# Altium project Artix Express UltraScale v2_2023-02-28T07_25_07_UTC.PrjPcb (part 2 of 7)

## Sheet FMC HPC Connector.SchDoc
size A1; SheetNumber: 13; SheetTotal: 16
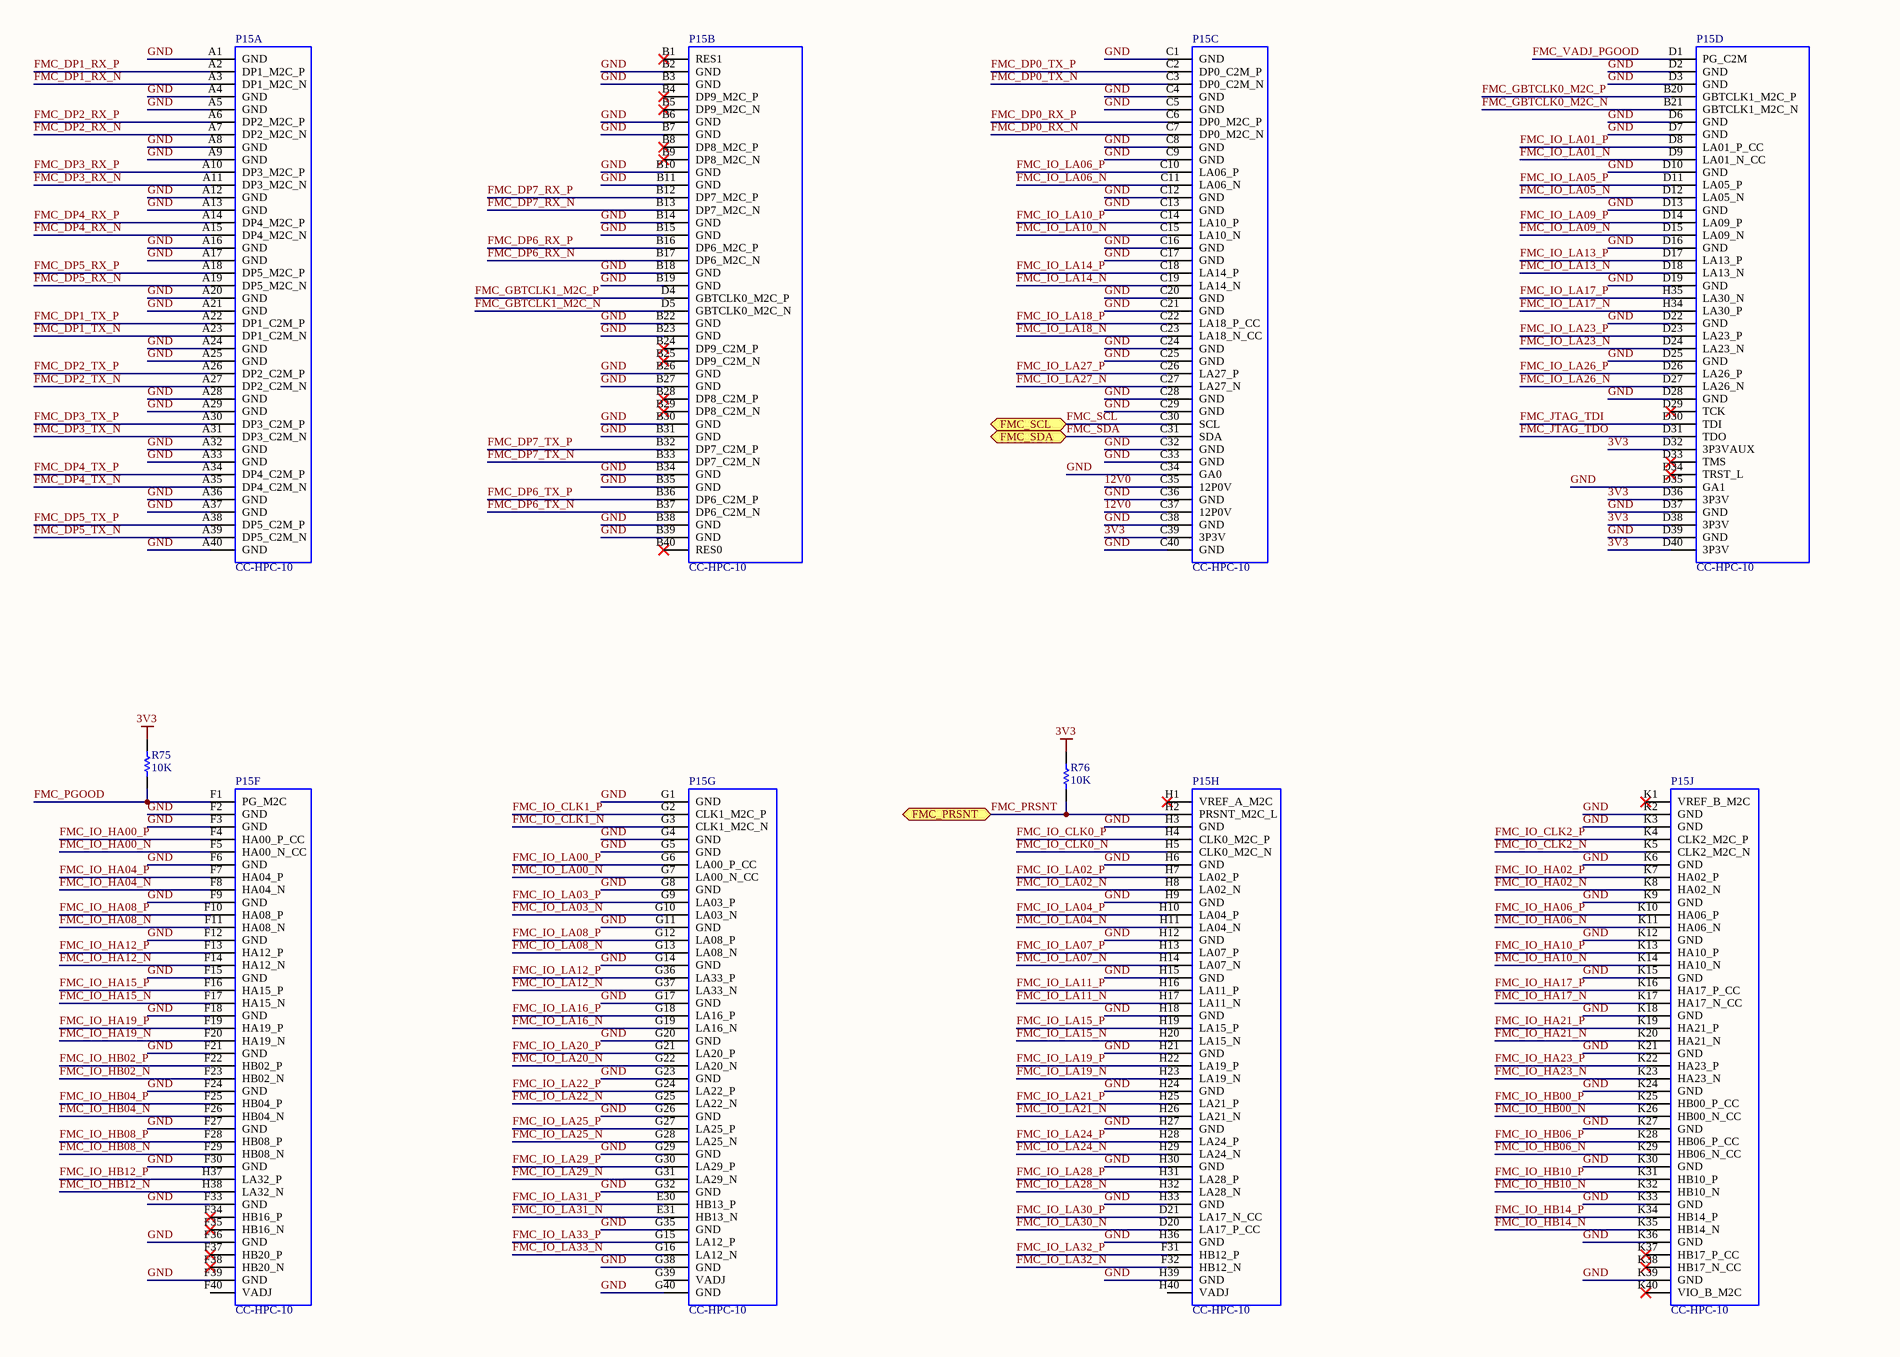
[diagram p3: FMC HPC Connector.SchDoc, top left]
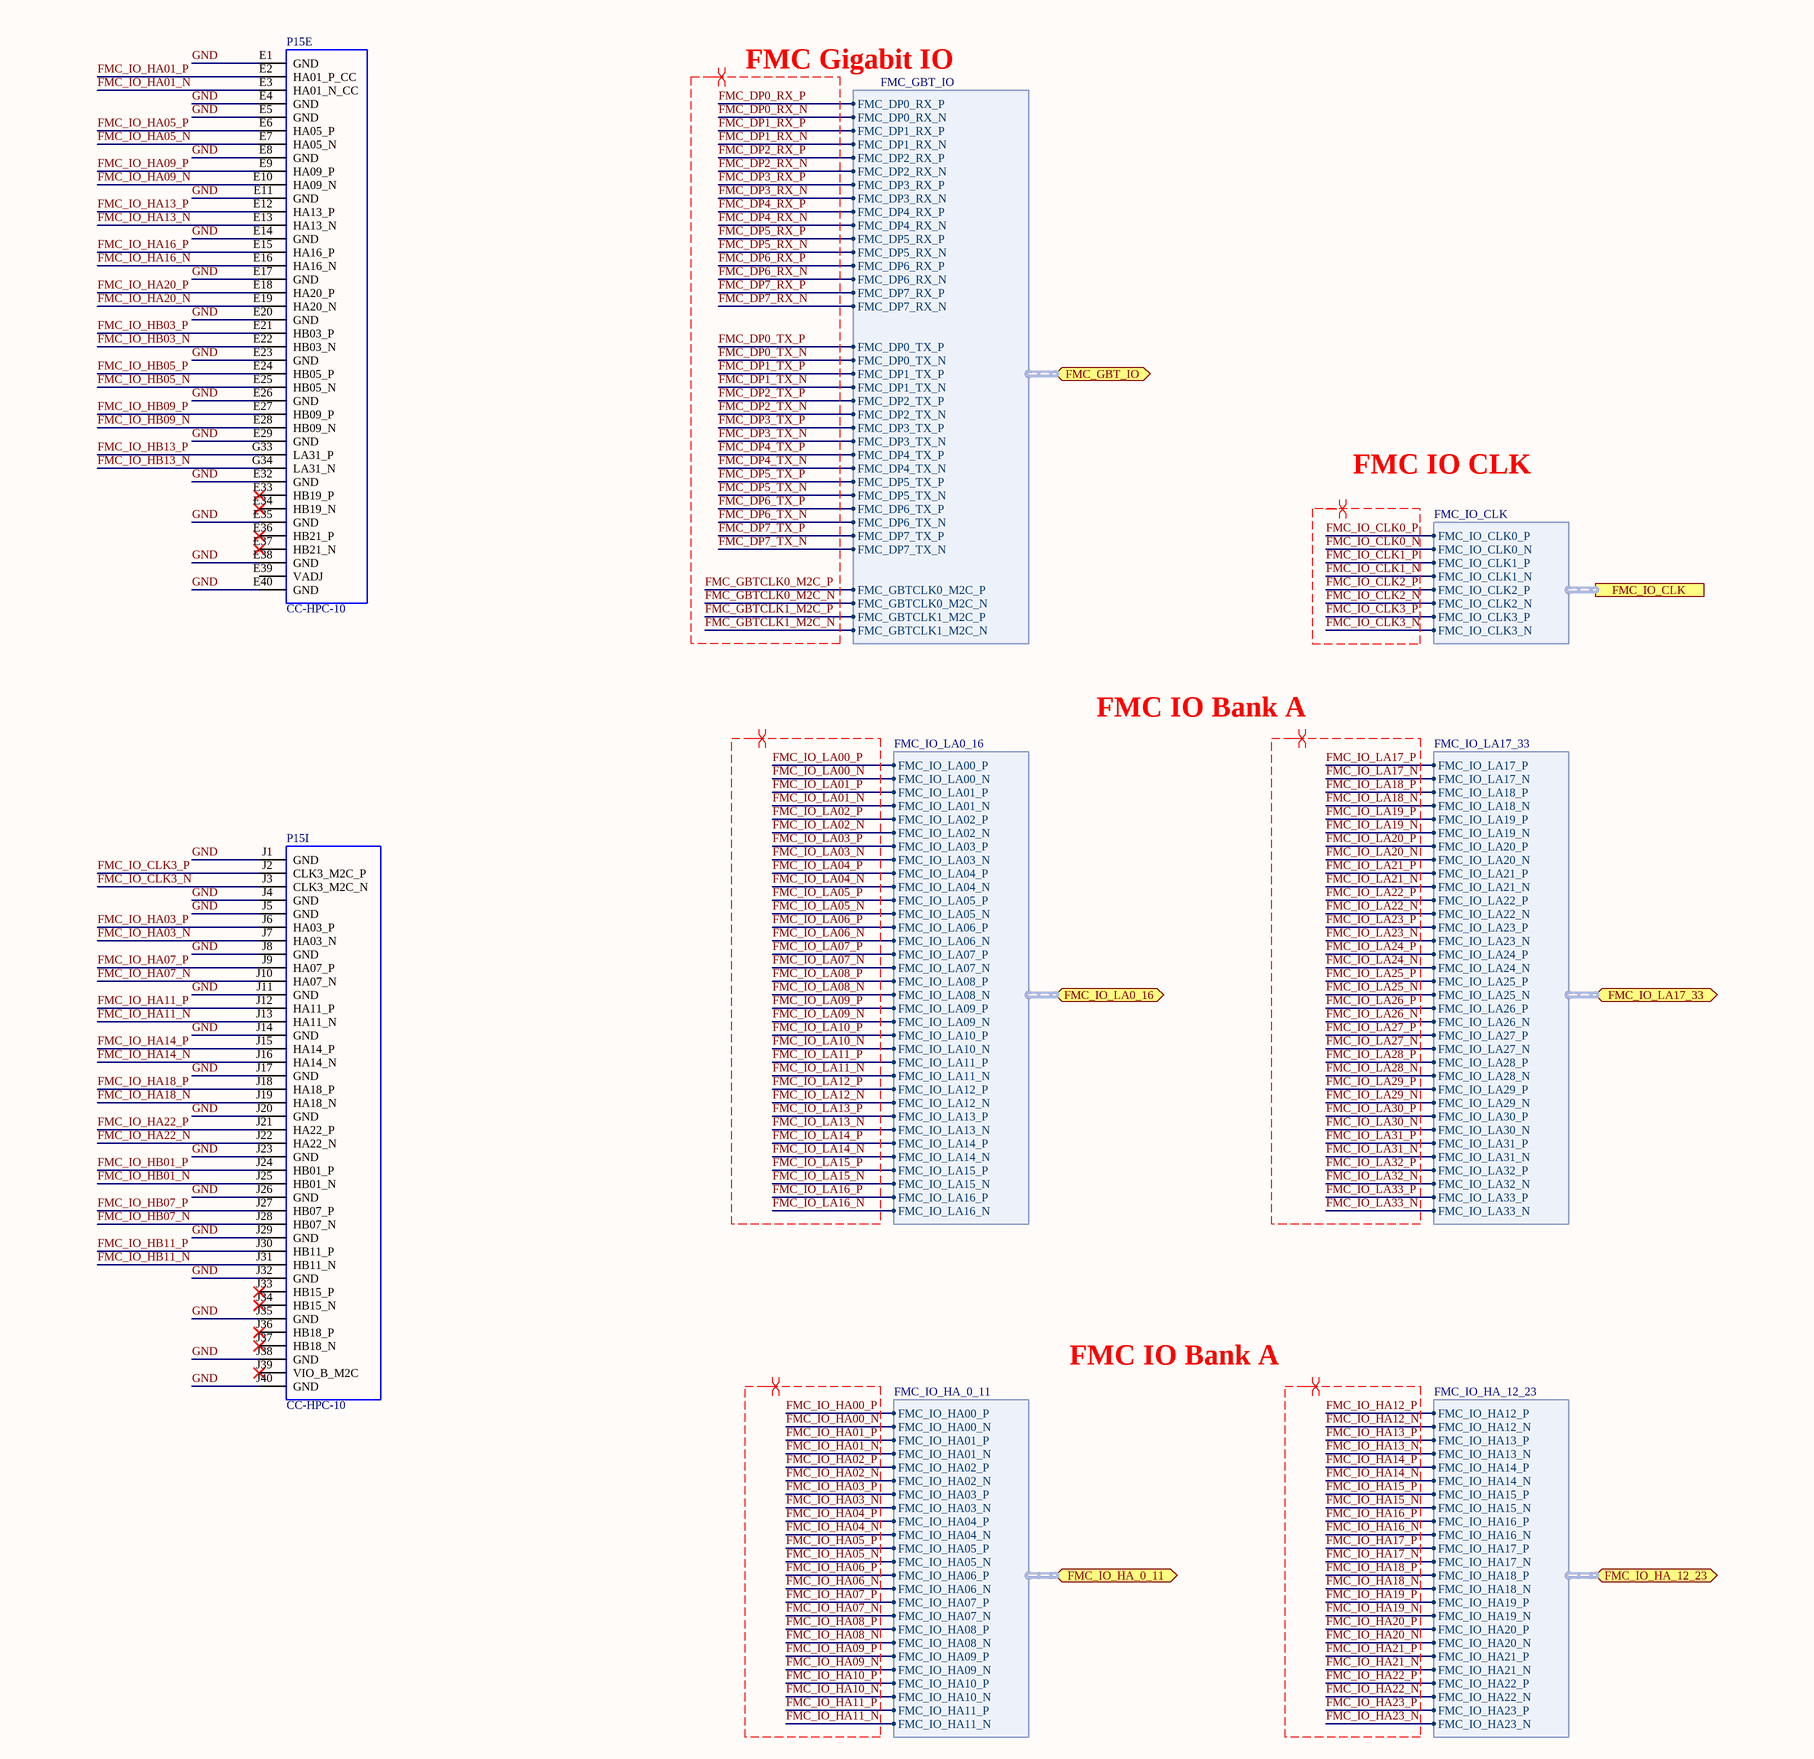
[diagram p4: FMC HPC Connector.SchDoc, top right]
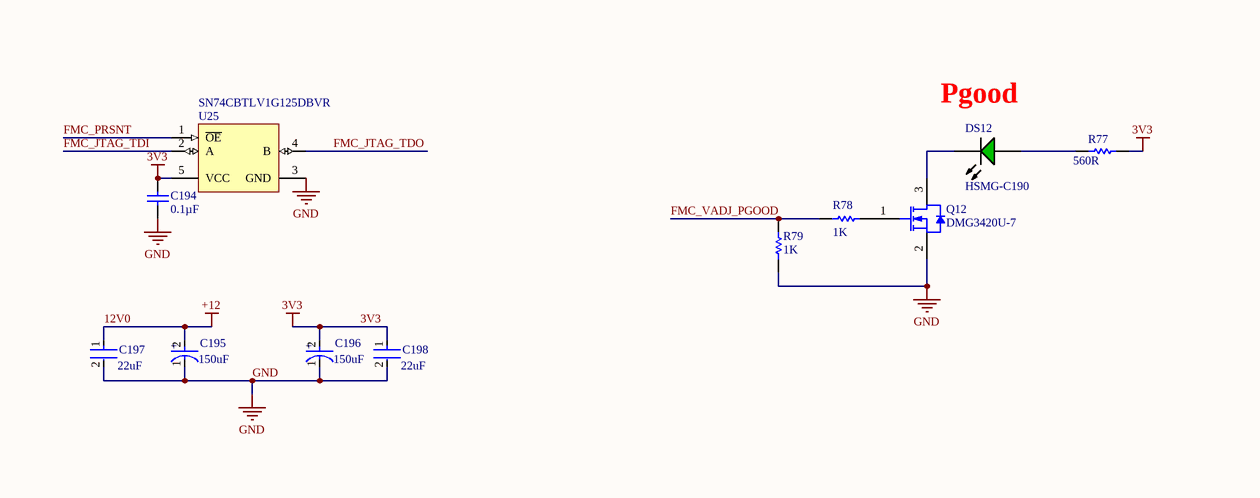
[diagram p5: FMC HPC Connector.SchDoc, bottom left]
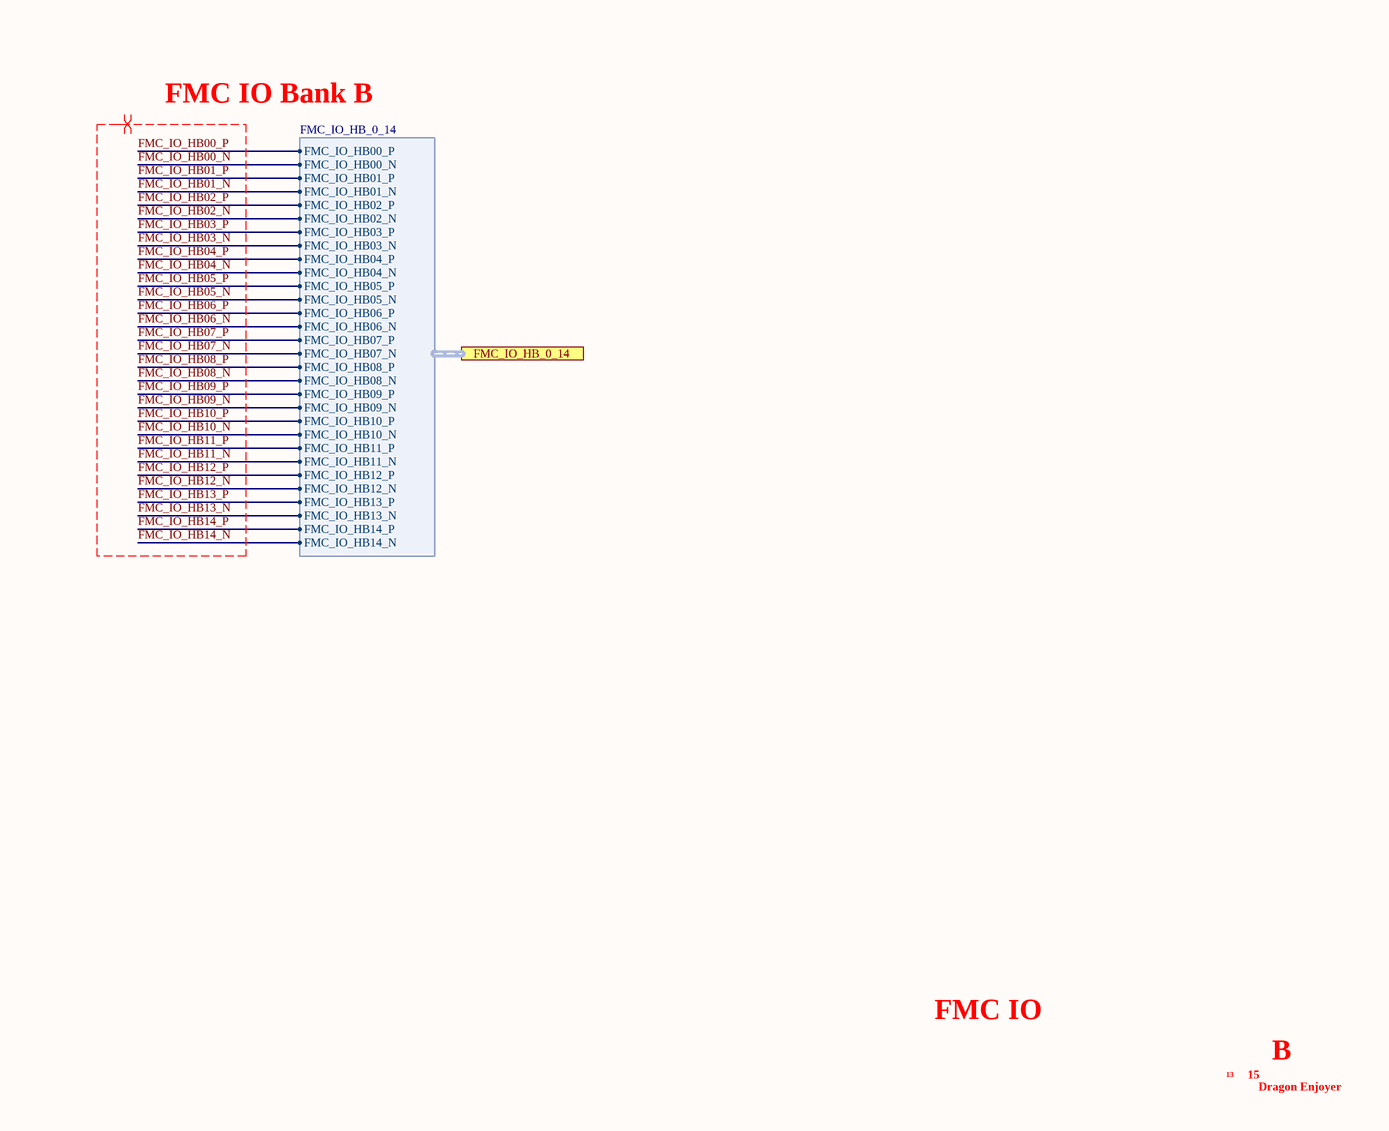
[diagram p6: FMC HPC Connector.SchDoc, bottom right]

### Parts
C194  Capacitance: 0.1µF  [CAPC1005X55X25LL05T05]  (hidden comment: CC0402ZRY5V8BB104)
C195  Capacitance: 150uF  [FP-TAJV-MFG]  (hidden comment: TAJV157M025RNJ)
C196  Capacitance: 150uF  [FP-TAJV-MFG]  (hidden comment: TAJV157M025RNJ)
C197  value 22uF  [FP-CL31H-0_2-MFG]  (hidden comment: CL31A226KAHNNNE)
C198  value 22uF  [FP-CL31H-0_2-MFG]  (hidden comment: CL31A226KAHNNNE)
DS12  HSMG-C190  [AVAG-HSMX-C190_V]
P15  CC-HPC-10  [ASP-134486-01]  (parts A,B,C,D,E,F,G,H,I,J of 10)
Q12  DMG3420U-7  [DIOD-SOT23-3_B_V]
R75  10K  [RESC1005X40X25NL05T05]
R76  10K  [RESC1005X40X25NL05T05]
R77  value 560R  [RESC1608X55X30LL20T20]  (hidden comment: ERA3AEB561V)
R78  value 1K  [RESC1005X40X25NL05T10]  (hidden comment: RC0402FR-071KL)
R79  value 1K  [RESC1005X40X25NL05T10]  (hidden comment: RC0402FR-071KL)
U25  SN74CBTLV1G125DBVR  [DBV0005A_N]

### Ports
FMC_GBT_IO (bidir, harness FMC_GBT_IO), FMC_IO_CLK (harness FMC_IO_CLK), FMC_IO_HA_0_11 (bidir, harness FMC_IO_HA_0_11), FMC_IO_HA_12_23 (bidir, harness FMC_IO_HA_12_23), FMC_IO_HB_0_14 (harness FMC_IO_HB_0_14), FMC_IO_LA0_16 (bidir, harness FMC_IO_LA0_16), FMC_IO_LA17_33 (bidir, harness FMC_IO_LA17_33), FMC_PRSNT (bidir), FMC_SCL (bidir), FMC_SDA (bidir)

### Harnesses
FMC_GBT_IO: FMC_DP0_RX_P, FMC_DP0_RX_N, FMC_DP1_RX_P, FMC_DP1_RX_N, FMC_DP2_RX_P, FMC_DP2_RX_N, FMC_DP3_RX_P, FMC_DP3_RX_N, FMC_DP4_RX_P, FMC_DP4_RX_N, FMC_DP5_RX_P, FMC_DP5_RX_N, FMC_DP6_RX_P, FMC_DP6_RX_N, FMC_DP7_RX_P, FMC_DP7_RX_N, FMC_DP0_TX_P, FMC_DP0_TX_N, FMC_DP1_TX_P, FMC_DP1_TX_N, FMC_DP2_TX_P, FMC_DP2_TX_N, FMC_DP3_TX_P, FMC_DP3_TX_N, FMC_DP4_TX_P, FMC_DP4_TX_N, FMC_DP5_TX_P, FMC_DP5_TX_N, FMC_DP6_TX_P, FMC_DP6_TX_N, FMC_DP7_TX_P, FMC_DP7_TX_N, FMC_GBTCLK0_M2C_P, FMC_GBTCLK0_M2C_N, FMC_GBTCLK1_M2C_P, FMC_GBTCLK1_M2C_N
FMC_IO_LA0_16: FMC_IO_LA00_P, FMC_IO_LA00_N, FMC_IO_LA01_P, FMC_IO_LA01_N, FMC_IO_LA02_P, FMC_IO_LA02_N, FMC_IO_LA03_P, FMC_IO_LA03_N, FMC_IO_LA04_P, FMC_IO_LA04_N, FMC_IO_LA05_P, FMC_IO_LA05_N, FMC_IO_LA06_P, FMC_IO_LA06_N, FMC_IO_LA07_P, FMC_IO_LA07_N, FMC_IO_LA08_P, FMC_IO_LA08_N, FMC_IO_LA09_P, FMC_IO_LA09_N, FMC_IO_LA10_P, FMC_IO_LA10_N, FMC_IO_LA11_P, FMC_IO_LA11_N, FMC_IO_LA12_P, FMC_IO_LA12_N, FMC_IO_LA13_P, FMC_IO_LA13_N, FMC_IO_LA14_P, FMC_IO_LA14_N, FMC_IO_LA15_P, FMC_IO_LA15_N, FMC_IO_LA16_P, FMC_IO_LA16_N
FMC_IO_LA17_33: FMC_IO_LA17_P, FMC_IO_LA17_N, FMC_IO_LA18_P, FMC_IO_LA18_N, FMC_IO_LA19_P, FMC_IO_LA19_N, FMC_IO_LA20_P, FMC_IO_LA20_N, FMC_IO_LA21_P, FMC_IO_LA21_N, FMC_IO_LA22_P, FMC_IO_LA22_N, FMC_IO_LA23_P, FMC_IO_LA23_N, FMC_IO_LA24_P, FMC_IO_LA24_N, FMC_IO_LA25_P, FMC_IO_LA25_N, FMC_IO_LA26_P, FMC_IO_LA26_N, FMC_IO_LA27_P, FMC_IO_LA27_N, FMC_IO_LA28_P, FMC_IO_LA28_N, FMC_IO_LA29_P, FMC_IO_LA29_N, FMC_IO_LA30_P, FMC_IO_LA30_N, FMC_IO_LA31_P, FMC_IO_LA31_N, FMC_IO_LA32_P, FMC_IO_LA32_N, FMC_IO_LA33_P, FMC_IO_LA33_N
FMC_IO_HA_0_11: FMC_IO_HA00_P, FMC_IO_HA00_N, FMC_IO_HA01_P, FMC_IO_HA01_N, FMC_IO_HA02_P, FMC_IO_HA02_N, FMC_IO_HA03_P, FMC_IO_HA03_N, FMC_IO_HA04_P, FMC_IO_HA04_N, FMC_IO_HA05_P, FMC_IO_HA05_N, FMC_IO_HA06_P, FMC_IO_HA06_N, FMC_IO_HA07_P, FMC_IO_HA07_N, FMC_IO_HA08_P, FMC_IO_HA08_N, FMC_IO_HA09_P, FMC_IO_HA09_N, FMC_IO_HA10_P, FMC_IO_HA10_N, FMC_IO_HA11_P, FMC_IO_HA11_N
FMC_IO_HA_12_23: FMC_IO_HA12_P, FMC_IO_HA12_N, FMC_IO_HA13_P, FMC_IO_HA13_N, FMC_IO_HA14_P, FMC_IO_HA14_N, FMC_IO_HA15_P, FMC_IO_HA15_N, FMC_IO_HA16_P, FMC_IO_HA16_N, FMC_IO_HA17_P, FMC_IO_HA17_N, FMC_IO_HA18_P, FMC_IO_HA18_N, FMC_IO_HA19_P, FMC_IO_HA19_N, FMC_IO_HA20_P, FMC_IO_HA20_N, FMC_IO_HA21_P, FMC_IO_HA21_N, FMC_IO_HA22_P, FMC_IO_HA22_N, FMC_IO_HA23_P, FMC_IO_HA23_N
FMC_IO_CLK: FMC_IO_CLK0_P, FMC_IO_CLK0_N, FMC_IO_CLK1_P, FMC_IO_CLK1_N, FMC_IO_CLK2_P, FMC_IO_CLK2_N, FMC_IO_CLK3_P, FMC_IO_CLK3_N
FMC_IO_HB_0_14: FMC_IO_HB00_P, FMC_IO_HB00_N, FMC_IO_HB01_P, FMC_IO_HB01_N, FMC_IO_HB02_P, FMC_IO_HB02_N, FMC_IO_HB03_P, FMC_IO_HB03_N, FMC_IO_HB04_P, FMC_IO_HB04_N, FMC_IO_HB05_P, FMC_IO_HB05_N, FMC_IO_HB06_P, FMC_IO_HB06_N, FMC_IO_HB07_P, FMC_IO_HB07_N, FMC_IO_HB08_P, FMC_IO_HB08_N, FMC_IO_HB09_P, FMC_IO_HB09_N, FMC_IO_HB10_P, FMC_IO_HB10_N, FMC_IO_HB11_P, FMC_IO_HB11_N, FMC_IO_HB12_P, FMC_IO_HB12_N, FMC_IO_HB13_P, FMC_IO_HB13_N, FMC_IO_HB14_P, FMC_IO_HB14_N

### Nets
3V3: C194.2 C196.2(A) C198.1 P15.C39(3P3V) P15.D32(3P3VAUX) P15.D36(3P3V) P15.D38(3P3V) P15.D40(3P3V) R75.2 R76.2 R77.2 U25.5(VCC)  [project net +3V3]
+12: C195.2(A) C197.1 P15.C35(12P0V) P15.C37(12P0V)  [also labelled 12V0]
GND: C194.1 C195.1(C) C196.1(C) C197.2 C198.2 P15.A1(GND) P15.A4(GND) P15.A5(GND) P15.A8(GND) P15.A9(GND) P15.A12(GND) P15.A13(GND) P15.A16(GND) P15.A17(GND) P15.A20(GND) P15.A21(GND) P15.A24(GND) P15.A25(GND) P15.A28(GND) P15.A29(GND) P15.A32(GND) P15.A33(GND) P15.A36(GND) P15.A37(GND) P15.A40(GND) P15.B2(GND) P15.B3(GND) P15.B6(GND) P15.B7(GND) P15.B10(GND) P15.B11(GND) P15.B14(GND) P15.B15(GND) P15.B18(GND) P15.B19(GND) P15.B22(GND) P15.B23(GND) P15.B26(GND) P15.B27(GND) P15.B30(GND) P15.B31(GND) P15.B34(GND) P15.B35(GND) P15.B38(GND) P15.B39(GND) P15.C1(GND) P15.C4(GND) P15.C5(GND) P15.C8(GND) P15.C9(GND) P15.C12(GND) P15.C13(GND) P15.C16(GND) P15.C17(GND) P15.C20(GND) P15.C21(GND) P15.C24(GND) P15.C25(GND) P15.C28(GND) P15.C29(GND) P15.C32(GND) P15.C33(GND) P15.C34(GA0) P15.C36(GND) P15.C38(GND) P15.C40(GND) P15.D2(GND) P15.D3(GND) P15.D6(GND) P15.D7(GND) P15.D10(GND) P15.D13(GND) P15.D16(GND) P15.D19(GND) P15.D22(GND) P15.D25(GND) P15.D28(GND) P15.D35(GA1) P15.D37(GND) P15.D39(GND) P15.E1(GND) P15.E4(GND) P15.E5(GND) P15.E8(GND) P15.E11(GND) P15.E14(GND) P15.E17(GND) P15.E20(GND) P15.E23(GND) P15.E26(GND) P15.E29(GND) P15.E32(GND) P15.E35(GND) P15.E38(GND) P15.E40(GND) P15.F2(GND) P15.F3(GND) P15.F6(GND) P15.F9(GND) P15.F12(GND) P15.F15(GND) P15.F18(GND) P15.F21(GND) P15.F24(GND) P15.F27(GND) P15.F30(GND) P15.F33(GND) P15.F36(GND) P15.F39(GND) P15.G1(GND) P15.G4(GND) P15.G5(GND) P15.G8(GND) P15.G11(GND) P15.G14(GND) P15.G17(GND) P15.G20(GND) P15.G23(GND) P15.G26(GND) P15.G29(GND) P15.G32(GND) P15.G35(GND) P15.G38(GND) P15.G40(GND) P15.H3(GND) P15.H6(GND) P15.H9(GND) P15.H12(GND) P15.H15(GND) P15.H18(GND) P15.H21(GND) P15.H24(GND) P15.H27(GND) P15.H30(GND) P15.H33(GND) P15.H36(GND) P15.H39(GND) P15.J1(GND) P15.J4(GND) P15.J5(GND) P15.J8(GND) P15.J11(GND) P15.J14(GND) P15.J17(GND) P15.J20(GND) P15.J23(GND) P15.J26(GND) P15.J29(GND) P15.J32(GND) P15.J35(GND) P15.J38(GND) P15.J40(GND) P15.K2(GND) P15.K3(GND) P15.K6(GND) P15.K9(GND) P15.K12(GND) P15.K15(GND) P15.K18(GND) P15.K21(GND) P15.K24(GND) P15.K27(GND) P15.K30(GND) P15.K33(GND) P15.K36(GND) P15.K39(GND) Q12.2(S) R79.1 U25.3(GND)
FMC_DP0_RX_N: P15.C7(DP0_M2C_N) ; port FMC_GBT_IO.FMC_DP0_RX_N
FMC_DP0_RX_P: P15.C6(DP0_M2C_P) ; port FMC_GBT_IO.FMC_DP0_RX_P
FMC_DP0_TX_N: P15.C3(DP0_C2M_N) ; port FMC_GBT_IO.FMC_DP0_TX_N
FMC_DP0_TX_P: P15.C2(DP0_C2M_P) ; port FMC_GBT_IO.FMC_DP0_TX_P
FMC_DP1_RX_N: P15.A3(DP1_M2C_N) ; port FMC_GBT_IO.FMC_DP1_RX_N
FMC_DP1_RX_P: P15.A2(DP1_M2C_P) ; port FMC_GBT_IO.FMC_DP1_RX_P
FMC_DP1_TX_N: P15.A23(DP1_C2M_N) ; port FMC_GBT_IO.FMC_DP1_TX_N
FMC_DP1_TX_P: P15.A22(DP1_C2M_P) ; port FMC_GBT_IO.FMC_DP1_TX_P
FMC_DP2_RX_N: P15.A7(DP2_M2C_N) ; port FMC_GBT_IO.FMC_DP2_RX_N
FMC_DP2_RX_P: P15.A6(DP2_M2C_P) ; port FMC_GBT_IO.FMC_DP2_RX_P
FMC_DP2_TX_N: P15.A27(DP2_C2M_N) ; port FMC_GBT_IO.FMC_DP2_TX_N
FMC_DP2_TX_P: P15.A26(DP2_C2M_P) ; port FMC_GBT_IO.FMC_DP2_TX_P
FMC_DP3_RX_N: P15.A11(DP3_M2C_N) ; port FMC_GBT_IO.FMC_DP3_RX_N
FMC_DP3_RX_P: P15.A10(DP3_M2C_P) ; port FMC_GBT_IO.FMC_DP3_RX_P
FMC_DP3_TX_N: P15.A31(DP3_C2M_N) ; port FMC_GBT_IO.FMC_DP3_TX_N
FMC_DP3_TX_P: P15.A30(DP3_C2M_P) ; port FMC_GBT_IO.FMC_DP3_TX_P
FMC_DP4_RX_N: P15.A15(DP4_M2C_N) ; port FMC_GBT_IO.FMC_DP4_RX_N
FMC_DP4_RX_P: P15.A14(DP4_M2C_P) ; port FMC_GBT_IO.FMC_DP4_RX_P
FMC_DP4_TX_N: P15.A35(DP4_C2M_N) ; port FMC_GBT_IO.FMC_DP4_TX_N
FMC_DP4_TX_P: P15.A34(DP4_C2M_P) ; port FMC_GBT_IO.FMC_DP4_TX_P
FMC_DP5_RX_N: P15.A19(DP5_M2C_N) ; port FMC_GBT_IO.FMC_DP5_RX_N
FMC_DP5_RX_P: P15.A18(DP5_M2C_P) ; port FMC_GBT_IO.FMC_DP5_RX_P
FMC_DP5_TX_N: P15.A39(DP5_C2M_N) ; port FMC_GBT_IO.FMC_DP5_TX_N
FMC_DP5_TX_P: P15.A38(DP5_C2M_P) ; port FMC_GBT_IO.FMC_DP5_TX_P
FMC_DP6_RX_N: P15.B17(DP6_M2C_N) ; port FMC_GBT_IO.FMC_DP6_RX_N
FMC_DP6_RX_P: P15.B16(DP6_M2C_P) ; port FMC_GBT_IO.FMC_DP6_RX_P
FMC_DP6_TX_N: P15.B37(DP6_C2M_N) ; port FMC_GBT_IO.FMC_DP6_TX_N
FMC_DP6_TX_P: P15.B36(DP6_C2M_P) ; port FMC_GBT_IO.FMC_DP6_TX_P
FMC_DP7_RX_N: P15.B13(DP7_M2C_N) ; port FMC_GBT_IO.FMC_DP7_RX_N
FMC_DP7_RX_P: P15.B12(DP7_M2C_P) ; port FMC_GBT_IO.FMC_DP7_RX_P
FMC_DP7_TX_N: P15.B33(DP7_C2M_N) ; port FMC_GBT_IO.FMC_DP7_TX_N
FMC_DP7_TX_P: P15.B32(DP7_C2M_P) ; port FMC_GBT_IO.FMC_DP7_TX_P
FMC_GBTCLK0_M2C_N: P15.B21(GBTCLK1_M2C_N) ; port FMC_GBT_IO.FMC_GBTCLK0_M2C_N
FMC_GBTCLK0_M2C_P: P15.B20(GBTCLK1_M2C_P) ; port FMC_GBT_IO.FMC_GBTCLK0_M2C_P
FMC_GBTCLK1_M2C_N: P15.D5(GBTCLK0_M2C_N) ; port FMC_GBT_IO.FMC_GBTCLK1_M2C_N
FMC_GBTCLK1_M2C_P: P15.D4(GBTCLK0_M2C_P) ; port FMC_GBT_IO.FMC_GBTCLK1_M2C_P
FMC_IO_CLK0_N: P15.H5(CLK0_M2C_N) ; port FMC_IO_CLK.FMC_IO_CLK0_N
FMC_IO_CLK0_P: P15.H4(CLK0_M2C_P) ; port FMC_IO_CLK.FMC_IO_CLK0_P
FMC_IO_CLK1_N: P15.G3(CLK1_M2C_N) ; port FMC_IO_CLK.FMC_IO_CLK1_N
FMC_IO_CLK1_P: P15.G2(CLK1_M2C_P) ; port FMC_IO_CLK.FMC_IO_CLK1_P
FMC_IO_CLK2_N: P15.K5(CLK2_M2C_N) ; port FMC_IO_CLK.FMC_IO_CLK2_N
FMC_IO_CLK2_P: P15.K4(CLK2_M2C_P) ; port FMC_IO_CLK.FMC_IO_CLK2_P
FMC_IO_CLK3_N: P15.J3(CLK3_M2C_N) ; port FMC_IO_CLK.FMC_IO_CLK3_N
FMC_IO_CLK3_P: P15.J2(CLK3_M2C_P) ; port FMC_IO_CLK.FMC_IO_CLK3_P
FMC_IO_HA00_N: P15.F5(HA00_N_CC) ; port FMC_IO_HA_0_11.FMC_IO_HA00_N
FMC_IO_HA00_P: P15.F4(HA00_P_CC) ; port FMC_IO_HA_0_11.FMC_IO_HA00_P
FMC_IO_HA01_N: P15.E3(HA01_N_CC) ; port FMC_IO_HA_0_11.FMC_IO_HA01_N
FMC_IO_HA01_P: P15.E2(HA01_P_CC) ; port FMC_IO_HA_0_11.FMC_IO_HA01_P
FMC_IO_HA02_N: P15.K8(HA02_N) ; port FMC_IO_HA_0_11.FMC_IO_HA02_N
FMC_IO_HA02_P: P15.K7(HA02_P) ; port FMC_IO_HA_0_11.FMC_IO_HA02_P
FMC_IO_HA03_N: P15.J7(HA03_N) ; port FMC_IO_HA_0_11.FMC_IO_HA03_N
FMC_IO_HA03_P: P15.J6(HA03_P) ; port FMC_IO_HA_0_11.FMC_IO_HA03_P
FMC_IO_HA04_N: P15.F8(HA04_N) ; port FMC_IO_HA_0_11.FMC_IO_HA04_N
FMC_IO_HA04_P: P15.F7(HA04_P) ; port FMC_IO_HA_0_11.FMC_IO_HA04_P
FMC_IO_HA05_N: P15.E7(HA05_N) ; port FMC_IO_HA_0_11.FMC_IO_HA05_N
FMC_IO_HA05_P: P15.E6(HA05_P) ; port FMC_IO_HA_0_11.FMC_IO_HA05_P
FMC_IO_HA06_N: P15.K11(HA06_N) ; port FMC_IO_HA_0_11.FMC_IO_HA06_N
FMC_IO_HA06_P: P15.K10(HA06_P) ; port FMC_IO_HA_0_11.FMC_IO_HA06_P
FMC_IO_HA07_N: P15.J10(HA07_N) ; port FMC_IO_HA_0_11.FMC_IO_HA07_N
FMC_IO_HA07_P: P15.J9(HA07_P) ; port FMC_IO_HA_0_11.FMC_IO_HA07_P
FMC_IO_HA08_N: P15.F11(HA08_N) ; port FMC_IO_HA_0_11.FMC_IO_HA08_N
FMC_IO_HA08_P: P15.F10(HA08_P) ; port FMC_IO_HA_0_11.FMC_IO_HA08_P
FMC_IO_HA09_N: P15.E10(HA09_N) ; port FMC_IO_HA_0_11.FMC_IO_HA09_N
FMC_IO_HA09_P: P15.E9(HA09_P) ; port FMC_IO_HA_0_11.FMC_IO_HA09_P
FMC_IO_HA10_N: P15.K14(HA10_N) ; port FMC_IO_HA_0_11.FMC_IO_HA10_N
FMC_IO_HA10_P: P15.K13(HA10_P) ; port FMC_IO_HA_0_11.FMC_IO_HA10_P
FMC_IO_HA11_N: P15.J13(HA11_N) ; port FMC_IO_HA_0_11.FMC_IO_HA11_N
FMC_IO_HA11_P: P15.J12(HA11_P) ; port FMC_IO_HA_0_11.FMC_IO_HA11_P
FMC_IO_HA12_N: P15.F14(HA12_N) ; port FMC_IO_HA_12_23.FMC_IO_HA12_N
FMC_IO_HA12_P: P15.F13(HA12_P) ; port FMC_IO_HA_12_23.FMC_IO_HA12_P
FMC_IO_HA13_N: P15.E13(HA13_N) ; port FMC_IO_HA_12_23.FMC_IO_HA13_N
FMC_IO_HA13_P: P15.E12(HA13_P) ; port FMC_IO_HA_12_23.FMC_IO_HA13_P
FMC_IO_HA14_N: P15.J16(HA14_N) ; port FMC_IO_HA_12_23.FMC_IO_HA14_N
FMC_IO_HA14_P: P15.J15(HA14_P) ; port FMC_IO_HA_12_23.FMC_IO_HA14_P
FMC_IO_HA15_N: P15.F17(HA15_N) ; port FMC_IO_HA_12_23.FMC_IO_HA15_N
FMC_IO_HA15_P: P15.F16(HA15_P) ; port FMC_IO_HA_12_23.FMC_IO_HA15_P
FMC_IO_HA16_N: P15.E16(HA16_N) ; port FMC_IO_HA_12_23.FMC_IO_HA16_N
FMC_IO_HA16_P: P15.E15(HA16_P) ; port FMC_IO_HA_12_23.FMC_IO_HA16_P
FMC_IO_HA17_N: P15.K17(HA17_N_CC) ; port FMC_IO_HA_12_23.FMC_IO_HA17_N
FMC_IO_HA17_P: P15.K16(HA17_P_CC) ; port FMC_IO_HA_12_23.FMC_IO_HA17_P
FMC_IO_HA18_N: P15.J19(HA18_N) ; port FMC_IO_HA_12_23.FMC_IO_HA18_N
FMC_IO_HA18_P: P15.J18(HA18_P) ; port FMC_IO_HA_12_23.FMC_IO_HA18_P
FMC_IO_HA19_N: P15.F20(HA19_N) ; port FMC_IO_HA_12_23.FMC_IO_HA19_N
FMC_IO_HA19_P: P15.F19(HA19_P) ; port FMC_IO_HA_12_23.FMC_IO_HA19_P
FMC_IO_HA20_N: P15.E19(HA20_N) ; port FMC_IO_HA_12_23.FMC_IO_HA20_N
FMC_IO_HA20_P: P15.E18(HA20_P) ; port FMC_IO_HA_12_23.FMC_IO_HA20_P
FMC_IO_HA21_N: P15.K20(HA21_N) ; port FMC_IO_HA_12_23.FMC_IO_HA21_N
FMC_IO_HA21_P: P15.K19(HA21_P) ; port FMC_IO_HA_12_23.FMC_IO_HA21_P
FMC_IO_HA22_N: P15.J22(HA22_N) ; port FMC_IO_HA_12_23.FMC_IO_HA22_N
FMC_IO_HA22_P: P15.J21(HA22_P) ; port FMC_IO_HA_12_23.FMC_IO_HA22_P
FMC_IO_HA23_N: P15.K23(HA23_N) ; port FMC_IO_HA_12_23.FMC_IO_HA23_N
FMC_IO_HA23_P: P15.K22(HA23_P) ; port FMC_IO_HA_12_23.FMC_IO_HA23_P
FMC_IO_HB00_N: P15.K26(HB00_N_CC) ; port FMC_IO_HB_0_14.FMC_IO_HB00_N
FMC_IO_HB00_P: P15.K25(HB00_P_CC) ; port FMC_IO_HB_0_14.FMC_IO_HB00_P
FMC_IO_HB01_N: P15.J25(HB01_N) ; port FMC_IO_HB_0_14.FMC_IO_HB01_N
FMC_IO_HB01_P: P15.J24(HB01_P) ; port FMC_IO_HB_0_14.FMC_IO_HB01_P
FMC_IO_HB02_N: P15.F23(HB02_N) ; port FMC_IO_HB_0_14.FMC_IO_HB02_N
FMC_IO_HB02_P: P15.F22(HB02_P) ; port FMC_IO_HB_0_14.FMC_IO_HB02_P
FMC_IO_HB03_N: P15.E22(HB03_N) ; port FMC_IO_HB_0_14.FMC_IO_HB03_N
FMC_IO_HB03_P: P15.E21(HB03_P) ; port FMC_IO_HB_0_14.FMC_IO_HB03_P
FMC_IO_HB04_N: P15.F26(HB04_N) ; port FMC_IO_HB_0_14.FMC_IO_HB04_N
FMC_IO_HB04_P: P15.F25(HB04_P) ; port FMC_IO_HB_0_14.FMC_IO_HB04_P
FMC_IO_HB05_N: P15.E25(HB05_N) ; port FMC_IO_HB_0_14.FMC_IO_HB05_N
FMC_IO_HB05_P: P15.E24(HB05_P) ; port FMC_IO_HB_0_14.FMC_IO_HB05_P
FMC_IO_HB06_N: P15.K29(HB06_N_CC) ; port FMC_IO_HB_0_14.FMC_IO_HB06_N
FMC_IO_HB06_P: P15.K28(HB06_P_CC) ; port FMC_IO_HB_0_14.FMC_IO_HB06_P
FMC_IO_HB07_N: P15.J28(HB07_N) ; port FMC_IO_HB_0_14.FMC_IO_HB07_N
FMC_IO_HB07_P: P15.J27(HB07_P) ; port FMC_IO_HB_0_14.FMC_IO_HB07_P
FMC_IO_HB08_N: P15.F29(HB08_N) ; port FMC_IO_HB_0_14.FMC_IO_HB08_N
FMC_IO_HB08_P: P15.F28(HB08_P) ; port FMC_IO_HB_0_14.FMC_IO_HB08_P
FMC_IO_HB09_N: P15.E28(HB09_N) ; port FMC_IO_HB_0_14.FMC_IO_HB09_N
FMC_IO_HB09_P: P15.E27(HB09_P) ; port FMC_IO_HB_0_14.FMC_IO_HB09_P
FMC_IO_HB10_N: P15.K32(HB10_N) ; port FMC_IO_HB_0_14.FMC_IO_HB10_N
FMC_IO_HB10_P: P15.K31(HB10_P) ; port FMC_IO_HB_0_14.FMC_IO_HB10_P
FMC_IO_HB11_N: P15.J31(HB11_N) ; port FMC_IO_HB_0_14.FMC_IO_HB11_N
FMC_IO_HB11_P: P15.J30(HB11_P) ; port FMC_IO_HB_0_14.FMC_IO_HB11_P
FMC_IO_HB12_N: P15.H38(LA32_N) ; port FMC_IO_HB_0_14.FMC_IO_HB12_N
FMC_IO_HB12_P: P15.H37(LA32_P) ; port FMC_IO_HB_0_14.FMC_IO_HB12_P
FMC_IO_HB13_N: P15.G34(LA31_N) ; port FMC_IO_HB_0_14.FMC_IO_HB13_N
FMC_IO_HB13_P: P15.G33(LA31_P) ; port FMC_IO_HB_0_14.FMC_IO_HB13_P
FMC_IO_HB14_N: P15.K35(HB14_N) ; port FMC_IO_HB_0_14.FMC_IO_HB14_N
FMC_IO_HB14_P: P15.K34(HB14_P) ; port FMC_IO_HB_0_14.FMC_IO_HB14_P
FMC_IO_LA00_N: P15.G7(LA00_N_CC) ; port FMC_IO_LA0_16.FMC_IO_LA00_N
FMC_IO_LA00_P: P15.G6(LA00_P_CC) ; port FMC_IO_LA0_16.FMC_IO_LA00_P
FMC_IO_LA01_N: P15.D9(LA01_N_CC) ; port FMC_IO_LA0_16.FMC_IO_LA01_N
FMC_IO_LA01_P: P15.D8(LA01_P_CC) ; port FMC_IO_LA0_16.FMC_IO_LA01_P
FMC_IO_LA02_N: P15.H8(LA02_N) ; port FMC_IO_LA0_16.FMC_IO_LA02_N
FMC_IO_LA02_P: P15.H7(LA02_P) ; port FMC_IO_LA0_16.FMC_IO_LA02_P
FMC_IO_LA03_N: P15.G10(LA03_N) ; port FMC_IO_LA0_16.FMC_IO_LA03_N
FMC_IO_LA03_P: P15.G9(LA03_P) ; port FMC_IO_LA0_16.FMC_IO_LA03_P
FMC_IO_LA04_N: P15.H11(LA04_N) ; port FMC_IO_LA0_16.FMC_IO_LA04_N
FMC_IO_LA04_P: P15.H10(LA04_P) ; port FMC_IO_LA0_16.FMC_IO_LA04_P
FMC_IO_LA05_N: P15.D12(LA05_N) ; port FMC_IO_LA0_16.FMC_IO_LA05_N
FMC_IO_LA05_P: P15.D11(LA05_P) ; port FMC_IO_LA0_16.FMC_IO_LA05_P
FMC_IO_LA06_N: P15.C11(LA06_N) ; port FMC_IO_LA0_16.FMC_IO_LA06_N
FMC_IO_LA06_P: P15.C10(LA06_P) ; port FMC_IO_LA0_16.FMC_IO_LA06_P
FMC_IO_LA07_N: P15.H14(LA07_N) ; port FMC_IO_LA0_16.FMC_IO_LA07_N
FMC_IO_LA07_P: P15.H13(LA07_P) ; port FMC_IO_LA0_16.FMC_IO_LA07_P
FMC_IO_LA08_N: P15.G13(LA08_N) ; port FMC_IO_LA0_16.FMC_IO_LA08_N
FMC_IO_LA08_P: P15.G12(LA08_P) ; port FMC_IO_LA0_16.FMC_IO_LA08_P
FMC_IO_LA09_N: P15.D15(LA09_N) ; port FMC_IO_LA0_16.FMC_IO_LA09_N
FMC_IO_LA09_P: P15.D14(LA09_P) ; port FMC_IO_LA0_16.FMC_IO_LA09_P
FMC_IO_LA10_N: P15.C15(LA10_N) ; port FMC_IO_LA0_16.FMC_IO_LA10_N
FMC_IO_LA10_P: P15.C14(LA10_P) ; port FMC_IO_LA0_16.FMC_IO_LA10_P
FMC_IO_LA11_N: P15.H17(LA11_N) ; port FMC_IO_LA0_16.FMC_IO_LA11_N
FMC_IO_LA11_P: P15.H16(LA11_P) ; port FMC_IO_LA0_16.FMC_IO_LA11_P
FMC_IO_LA12_N: P15.G37(LA33_N) ; port FMC_IO_LA0_16.FMC_IO_LA12_N
FMC_IO_LA12_P: P15.G36(LA33_P) ; port FMC_IO_LA0_16.FMC_IO_LA12_P
FMC_IO_LA13_N: P15.D18(LA13_N) ; port FMC_IO_LA0_16.FMC_IO_LA13_N
FMC_IO_LA13_P: P15.D17(LA13_P) ; port FMC_IO_LA0_16.FMC_IO_LA13_P
FMC_IO_LA14_N: P15.C19(LA14_N) ; port FMC_IO_LA0_16.FMC_IO_LA14_N
FMC_IO_LA14_P: P15.C18(LA14_P) ; port FMC_IO_LA0_16.FMC_IO_LA14_P
FMC_IO_LA15_N: P15.H20(LA15_N) ; port FMC_IO_LA0_16.FMC_IO_LA15_N
FMC_IO_LA15_P: P15.H19(LA15_P) ; port FMC_IO_LA0_16.FMC_IO_LA15_P
FMC_IO_LA16_N: P15.G19(LA16_N) ; port FMC_IO_LA0_16.FMC_IO_LA16_N
FMC_IO_LA16_P: P15.G18(LA16_P) ; port FMC_IO_LA0_16.FMC_IO_LA16_P
FMC_IO_LA17_N: P15.H34(LA30_P) ; port FMC_IO_LA17_33.FMC_IO_LA17_N
FMC_IO_LA17_P: P15.H35(LA30_N) ; port FMC_IO_LA17_33.FMC_IO_LA17_P
FMC_IO_LA18_N: P15.C23(LA18_N_CC) ; port FMC_IO_LA17_33.FMC_IO_LA18_N
FMC_IO_LA18_P: P15.C22(LA18_P_CC) ; port FMC_IO_LA17_33.FMC_IO_LA18_P
FMC_IO_LA19_N: P15.H23(LA19_N) ; port FMC_IO_LA17_33.FMC_IO_LA19_N
FMC_IO_LA19_P: P15.H22(LA19_P) ; port FMC_IO_LA17_33.FMC_IO_LA19_P
FMC_IO_LA20_N: P15.G22(LA20_N) ; port FMC_IO_LA17_33.FMC_IO_LA20_N
FMC_IO_LA20_P: P15.G21(LA20_P) ; port FMC_IO_LA17_33.FMC_IO_LA20_P
FMC_IO_LA21_N: P15.H26(LA21_N) ; port FMC_IO_LA17_33.FMC_IO_LA21_N
FMC_IO_LA21_P: P15.H25(LA21_P) ; port FMC_IO_LA17_33.FMC_IO_LA21_P
FMC_IO_LA22_N: P15.G25(LA22_N) ; port FMC_IO_LA17_33.FMC_IO_LA22_N
FMC_IO_LA22_P: P15.G24(LA22_P) ; port FMC_IO_LA17_33.FMC_IO_LA22_P
FMC_IO_LA23_N: P15.D24(LA23_N) ; port FMC_IO_LA17_33.FMC_IO_LA23_N
FMC_IO_LA23_P: P15.D23(LA23_P) ; port FMC_IO_LA17_33.FMC_IO_LA23_P
FMC_IO_LA24_N: P15.H29(LA24_N) ; port FMC_IO_LA17_33.FMC_IO_LA24_N
FMC_IO_LA24_P: P15.H28(LA24_P) ; port FMC_IO_LA17_33.FMC_IO_LA24_P
FMC_IO_LA25_N: P15.G28(LA25_N) ; port FMC_IO_LA17_33.FMC_IO_LA25_N
FMC_IO_LA25_P: P15.G27(LA25_P) ; port FMC_IO_LA17_33.FMC_IO_LA25_P
FMC_IO_LA26_N: P15.D27(LA26_N) ; port FMC_IO_LA17_33.FMC_IO_LA26_N
FMC_IO_LA26_P: P15.D26(LA26_P) ; port FMC_IO_LA17_33.FMC_IO_LA26_P
FMC_IO_LA27_N: P15.C27(LA27_N) ; port FMC_IO_LA17_33.FMC_IO_LA27_N
FMC_IO_LA27_P: P15.C26(LA27_P) ; port FMC_IO_LA17_33.FMC_IO_LA27_P
FMC_IO_LA28_N: P15.H32(LA28_N) ; port FMC_IO_LA17_33.FMC_IO_LA28_N
FMC_IO_LA28_P: P15.H31(LA28_P) ; port FMC_IO_LA17_33.FMC_IO_LA28_P
FMC_IO_LA29_N: P15.G31(LA29_N) ; port FMC_IO_LA17_33.FMC_IO_LA29_N
FMC_IO_LA29_P: P15.G30(LA29_P) ; port FMC_IO_LA17_33.FMC_IO_LA29_P
FMC_IO_LA30_N: P15.D20(LA17_P_CC) ; port FMC_IO_LA17_33.FMC_IO_LA30_N
FMC_IO_LA30_P: P15.D21(LA17_N_CC) ; port FMC_IO_LA17_33.FMC_IO_LA30_P
FMC_IO_LA31_N: P15.E31(HB13_N) ; port FMC_IO_LA17_33.FMC_IO_LA31_N
FMC_IO_LA31_P: P15.E30(HB13_P) ; port FMC_IO_LA17_33.FMC_IO_LA31_P
FMC_IO_LA32_N: P15.F32(HB12_N) ; port FMC_IO_LA17_33.FMC_IO_LA32_N
FMC_IO_LA32_P: P15.F31(HB12_P) ; port FMC_IO_LA17_33.FMC_IO_LA32_P
FMC_IO_LA33_N: P15.G16(LA12_N) ; port FMC_IO_LA17_33.FMC_IO_LA33_N
FMC_IO_LA33_P: P15.G15(LA12_P) ; port FMC_IO_LA17_33.FMC_IO_LA33_P
FMC_JTAG_TDI: P15.D30(TDI) U25.2(A)
FMC_JTAG_TDO: P15.D31(TDO) U25.4(B)
FMC_PGOOD: P15.F1(PG_M2C) R75.1
FMC_PRSNT: P15.H2(PRSNT_M2C_L) R76.1 U25.1(~{OE}) ; port FMC_PRSNT
FMC_SCL: P15.C30(SCL) ; port FMC_SCL
FMC_SDA: P15.C31(SDA) ; port FMC_SDA
FMC_VADJ_PGOOD: P15.D1(PG_C2M) R78.1 R79.2
NetDS12_1: DS12.1(A) R77.1
NetDS12_2: DS12.2(K) Q12.3(D)
NetQ12_1: Q12.1(G) R78.2

Not connected (* = marked no-connect by the designer): P15 B1(RES1)* B4(DP9_M2C_P)* B5(DP9_M2C_N)* B8(DP8_M2C_P)* B9(DP8_M2C_N)* B24(DP9_C2M_P)* B25(DP9_C2M_N)* B28(DP8_C2M_P)* B29(DP8_C2M_N)* B40(RES0)* D29(TCK)* D33(TMS)* D34(TRST_L)* E33(HB19_P)* E34(HB19_N)* E36(HB21_P)* E37(HB21_N)* E39(VADJ) F34(HB16_P)* F35(HB16_N)* F37(HB20_P)* F38(HB20_N)* F40(VADJ) G39(VADJ) H1(VREF_A_M2C)* H40(VADJ) J33(HB15_P)* J34(HB15_N)* J36(HB18_P)* J37(HB18_N)* J39(VIO_B_M2C)* K1(VREF_B_M2C)* K37(HB17_P_CC)* K38(HB17_N_CC)* K40(VIO_B_M2C)*

### Layout directives
differential pair: FMC_DP0_RX_N, FMC_DP0_RX_P, FMC_DP0_TX_N, FMC_DP0_TX_P, FMC_DP1_RX_N, FMC_DP1_RX_P, FMC_DP1_TX_N, FMC_DP1_TX_P, FMC_DP2_RX_N, FMC_DP2_RX_P, FMC_DP2_TX_N, FMC_DP2_TX_P, FMC_DP3_RX_N, FMC_DP3_RX_P, FMC_DP3_TX_N, FMC_DP3_TX_P, FMC_DP4_RX_N, FMC_DP4_RX_P, FMC_DP4_TX_N, FMC_DP4_TX_P, FMC_DP5_RX_N, FMC_DP5_RX_P, FMC_DP5_TX_N, FMC_DP5_TX_P, FMC_DP6_RX_N, FMC_DP6_RX_P, FMC_DP6_TX_N, FMC_DP6_TX_P, FMC_DP7_RX_N, FMC_DP7_RX_P, FMC_DP7_TX_N, FMC_DP7_TX_P, FMC_GBTCLK0_M2C_N, FMC_GBTCLK0_M2C_P, FMC_GBTCLK1_M2C_N, FMC_GBTCLK1_M2C_P, FMC_IO_CLK0_N, FMC_IO_CLK0_P, FMC_IO_CLK1_N, FMC_IO_CLK1_P, FMC_IO_CLK2_N, FMC_IO_CLK2_P, FMC_IO_CLK3_N, FMC_IO_CLK3_P, FMC_IO_HA00_N, FMC_IO_HA00_P, FMC_IO_HA01_N, FMC_IO_HA01_P, FMC_IO_HA02_N, FMC_IO_HA02_P, FMC_IO_HA03_N, FMC_IO_HA03_P, FMC_IO_HA04_N, FMC_IO_HA04_P, FMC_IO_HA05_N, FMC_IO_HA05_P, FMC_IO_HA06_N, FMC_IO_HA06_P, FMC_IO_HA07_N, FMC_IO_HA07_P, FMC_IO_HA08_N, FMC_IO_HA08_P, FMC_IO_HA09_N, FMC_IO_HA09_P, FMC_IO_HA10_N, FMC_IO_HA10_P, FMC_IO_HA11_N, FMC_IO_HA11_P, FMC_IO_HA12_N, FMC_IO_HA12_P, FMC_IO_HA13_N, FMC_IO_HA13_P, FMC_IO_HA14_N, FMC_IO_HA14_P, FMC_IO_HA15_N, FMC_IO_HA15_P, FMC_IO_HA16_N, FMC_IO_HA16_P, FMC_IO_HA17_N, FMC_IO_HA17_P, FMC_IO_HA18_N, FMC_IO_HA18_P, FMC_IO_HA19_N, FMC_IO_HA19_P, FMC_IO_HA20_N, FMC_IO_HA20_P, FMC_IO_HA21_N, FMC_IO_HA21_P, FMC_IO_HA22_N, FMC_IO_HA22_P, FMC_IO_HA23_N, FMC_IO_HA23_P, FMC_IO_HB00_N, FMC_IO_HB00_P, FMC_IO_HB01_N, FMC_IO_HB01_P, FMC_IO_HB02_N, FMC_IO_HB02_P, FMC_IO_HB03_N, FMC_IO_HB03_P, FMC_IO_HB04_N, FMC_IO_HB04_P, FMC_IO_HB05_N, FMC_IO_HB05_P, FMC_IO_HB06_N, FMC_IO_HB06_P, FMC_IO_HB07_N, FMC_IO_HB07_P, FMC_IO_HB08_N, FMC_IO_HB08_P, FMC_IO_HB09_N, FMC_IO_HB09_P, FMC_IO_HB10_N, FMC_IO_HB10_P, FMC_IO_HB11_N, FMC_IO_HB11_P, FMC_IO_HB12_N, FMC_IO_HB12_P, FMC_IO_HB13_N, FMC_IO_HB13_P, FMC_IO_HB14_N, FMC_IO_HB14_P, FMC_IO_LA00_N, FMC_IO_LA00_P, FMC_IO_LA01_N, FMC_IO_LA01_P, FMC_IO_LA02_N, FMC_IO_LA02_P, FMC_IO_LA03_N, FMC_IO_LA03_P, FMC_IO_LA04_N, FMC_IO_LA04_P, FMC_IO_LA05_N, FMC_IO_LA05_P, FMC_IO_LA06_N, FMC_IO_LA06_P, FMC_IO_LA07_N, FMC_IO_LA07_P, FMC_IO_LA08_N, FMC_IO_LA08_P, FMC_IO_LA09_N, FMC_IO_LA09_P, FMC_IO_LA10_N, FMC_IO_LA10_P, FMC_IO_LA11_N, FMC_IO_LA11_P, FMC_IO_LA12_N, FMC_IO_LA12_P, FMC_IO_LA13_N, FMC_IO_LA13_P, FMC_IO_LA14_N, FMC_IO_LA14_P, FMC_IO_LA15_N, FMC_IO_LA15_P, FMC_IO_LA16_N, FMC_IO_LA16_P, FMC_IO_LA17_N, FMC_IO_LA17_P, FMC_IO_LA18_N, FMC_IO_LA18_P, FMC_IO_LA19_N, FMC_IO_LA19_P, FMC_IO_LA20_N, FMC_IO_LA20_P, FMC_IO_LA21_N, FMC_IO_LA21_P, FMC_IO_LA22_N, FMC_IO_LA22_P, FMC_IO_LA23_N, FMC_IO_LA23_P, FMC_IO_LA24_N, FMC_IO_LA24_P, FMC_IO_LA25_N, FMC_IO_LA25_P, FMC_IO_LA26_N, FMC_IO_LA26_P, FMC_IO_LA27_N, FMC_IO_LA27_P, FMC_IO_LA28_N, FMC_IO_LA28_P, FMC_IO_LA29_N, FMC_IO_LA29_P, FMC_IO_LA30_N, FMC_IO_LA30_P, FMC_IO_LA31_N, FMC_IO_LA31_P, FMC_IO_LA32_N, FMC_IO_LA32_P, FMC_IO_LA33_N, FMC_IO_LA33_P

### Notes on the sheet
- FMC Gigabit IO
- FMC IO CLK
- FMC IO Bank A
- FMC IO Bank B
- (near DS12) Pgood
- FMC IO
- 13
- 15
- Dragon Enjoyer
- B
- (in symbol CMP-04424-000571-1) +

### Library data of the parts
C194 = CMP-2000-06071-1: as C123 on sheet DDR4 Memory; Datasheet URL: http://www.farnell.com/datasheets/1132289.pdf; Features: -; Package Description: 2-Pin Surface Mount Device, Body 1 x 0.5 mm; Standard Package: 1; Mounting Technology: SurfaceMount; Lead Style: -; Thickness (Max): 0.022"(0.55mm); Family: CeramicCapacitors; Series: CC; Applications: GeneralPurpose; Lead Spacing: -; Size / Dimension: 0.039"Lx0.020"W(1.00mmx0.50mm); Manufacturer URL: http://www.yageo.com/; Category: Capacitors; Datasheet Version: Rev. 5, 07/2010; Height - Seated (Max): -; Packaging: Digi-Reel®; Operating Temperature: -30°C~85°C; Mounting Type: SurfaceMount,MLCC; Package Reference: 0402; Ratings: -; Package / Case: 0402(1005Metric)
C195 C196 = CMP-04424-000571-1: 150uF 25V  ±20% 400mΩ 2924  SMD Tantalum Capacitor; ESR (Equivalent Series Resistance): 400mR; Dissipation Factor: 10%; Leakage Current: 37.5uA; Length: 7.3mm; Series: TAJ; Tolerance: 20%; Case Code (Imperial): 2924; Voltage Rating: 25V; Lead Free: Lead Free; Packaging: Tape and Reel; RoHS Compliant: Yes; Height: 3.8mm; Voltage Rating (DC): 25V; Min Operating Temperature: -55°C; Max Operating Temperature: 125°C; Case Code (Metric): 7361; Case/Package: 2924; Termination: SMD/SMT; Width: 6.1mm
C197 C198 = CMP-13271-000012-1: CAP CER 22UF 25V X5R 1206; Manufacturer: Samsung; Temperature Coefficient: 15%; Tolerance: 10%; Material: Ceramic; Automotive: No; Device Class L3: Ceramic Capacitors; Temperature: -55°C to +85°C; Octopart: https://octopart.com/cl31a226kahnnne-samsung-19832795; Temperature Range Low: -55°C; Voltage Rating: 25V; Height: 1.8mm; Temperature Characteristic: X5R; Package: CL31H-0.2; Temperature Range High: +85°C; ComponentLink2URL: http://www.samsungsem.com/kr/support/product-search/mlcc/__icsFiles/afieldfile/2019/05/10/19-CL31A226KAHNNNE.pdf; Ipc Land Pattern Name: CAPC320160X160; Lead Free: Yes; Device Class L2: Capacitors; Device Class L1: Passive Components; Capacitance: 22uF; Digikey Description: CAP CER 22UF 25V X5R 1206; Manufacturer Part Number: CL31A226KAHNNNE; RoHS: TRUE; Category: Cap; ComponentLink2Description: Datasheet
DS12 = CMP-1744-00002-1: Chip LED, Green, 2.2 V, -40 to 85 degC, 2-Pin SMD, RoHS, Tape and Reel; Frequency: 400 KHz; Max Supply Voltage: 5.5 V; Access Time: 3500 ns; Clock Frequency: 100 KHz; Case\Package: SOIC; Density: 32 kb; Nominal Supply Current: 2 mA; Interface: Serial; Min Supply Voltage: 1.7 V; Packaging: Tape and Reel; PackageReference: HSMX-C190; ComponentLink2URL: http://docs.avagotech.com/docs/AV02-0551EN; RoHSCompliant: true; Pins: 8; REACH SVHC: No SVHC; Max Operating Temperature: 85 degC; Width: 4 mm; Radiation Hardening: No; Package Quantity: 3000; ComponentLink3Description: Package Specification; ComponentLink1Description: Manufacturer URL; Min Operating Temperature: -40 degC; PackageDescription: 2-Pin Surface Mount Device, Body 1.6 x 0.8 mm, Height 0.9 mm; Max Clock Frequency: 100 KHz; Height: 1.5 mm; ComponentLink1URL: http://www.avagotech.com/; DatasheetVersion: Mar-12; ComponentLink2Description: Datasheet; Mount: Surface Mount; Length: 5 mm; ComponentLink3URL: http://www.fairchildsemi.com/dwg/MA/MA03D.pdf
P15 = CMP-005-000000-1: CC-HPC-10, FMC High-pin count connector, lead free, 400 I/Os, female, 10 mm mated stack height; Manufacturer Ref: SEAF-40-06.5-10-A; Manufacturer: Samtec; Mated Stack Height: 10 mm; Number I/O: 400; Pitch: 1.27 mm; Solder Type: Lead-Free; Design Item ID: CC-HPC-10; PartName: ASP-134486-01; Gender: female; Part: ASP-134486-01; Source: VITA_57_FMC.SchLib; Pin Count: High; Vita PartNumber: CC-HPC-10; Component Type: Standard; PartId: 1
Q12 = CMP-2000-06172-1: N-Channel Enhancement Mode MOSFET, 20 V, -55 to 150 degC, 3-Pin SOT23, RoHS, Tape and Reel; Manufacturer: Diodes Inc; Drain-Source On Resistance-Max: 29mO; Qg Gate Charge: 5.4nC; Drain-to-Source Voltage [Vdss]: 20V; Rated Power Dissipation: 740mW; Datasheet URL: http://www.diodes.com/_files/datasheets/ds31867.pdf; Package Description: 3-Pin Small Outline Transistor, Body 2.9 x 1.3 mm, Pitch 0.96 mm; Package Reference: SOT23-3; Datasheet Version: Rev. 5-2, 09/2013; Mounting Technology: SurfaceMount; Channel Type: N-Channel; Manufacturer URL: http://www.diodes.com/
R75 R76 = CMP-2002-08136-1: Manufacturer: Vishay Dale; Part Number: CRCW040210K0JNED
R77 = CMP-2000-00091-1: Manufacturer: Panasonic; Part Number: ERA3AEB561V
R78 R79 = CMP-2002-07472-1: Manufacturer: Yageo / Phycomp; Part Number: RC0402FR-071KL
U25 = CMP-0859-00160-3: Low-Voltage Single FET Bus Switch, DBV0005A, LARGE T&R; Manufacturer: Texas Instruments; Bits(#): 1; VCC(Max)(V): 3.6; Technology Family: CBTLV; tpd @ Nom Voltage(Max)(ns): 0.25; ICC @ Nom Voltage(Max)(mA): 0.01; Logic: True; Sub-Family: Analog Switch; 3-State Output: No; Switch Configuration: SPST; VCC(Min)(V): 2.3; F @ Nom Voltage(Max)(Mhz): 200; Rating: Catalog; Output Type: CMOS; Voltage(Nom)(V): 3.3; Input Type: LV-CMOS; PackageReference: DBV0005A; Operating Temperature Range(C): -40 to 85; Channels(#): 1; Schmitt Trigger: No; Generic Part Number: SN74CBTLV1G125; DatasheetVersion: SCDS057H